# Altium schematic sheet extBoard_sheet5_connectors.SchDoc: EXT BOARD - Connectors
size A4; Revision: 0.1.0; SheetNumber: 5; SheetTotal: 5; Author: NALO; DrawnBy: NALO; DocumentSize: A4; PCAName: EXT BOARD; ProjectName: Bachelor's Thesis
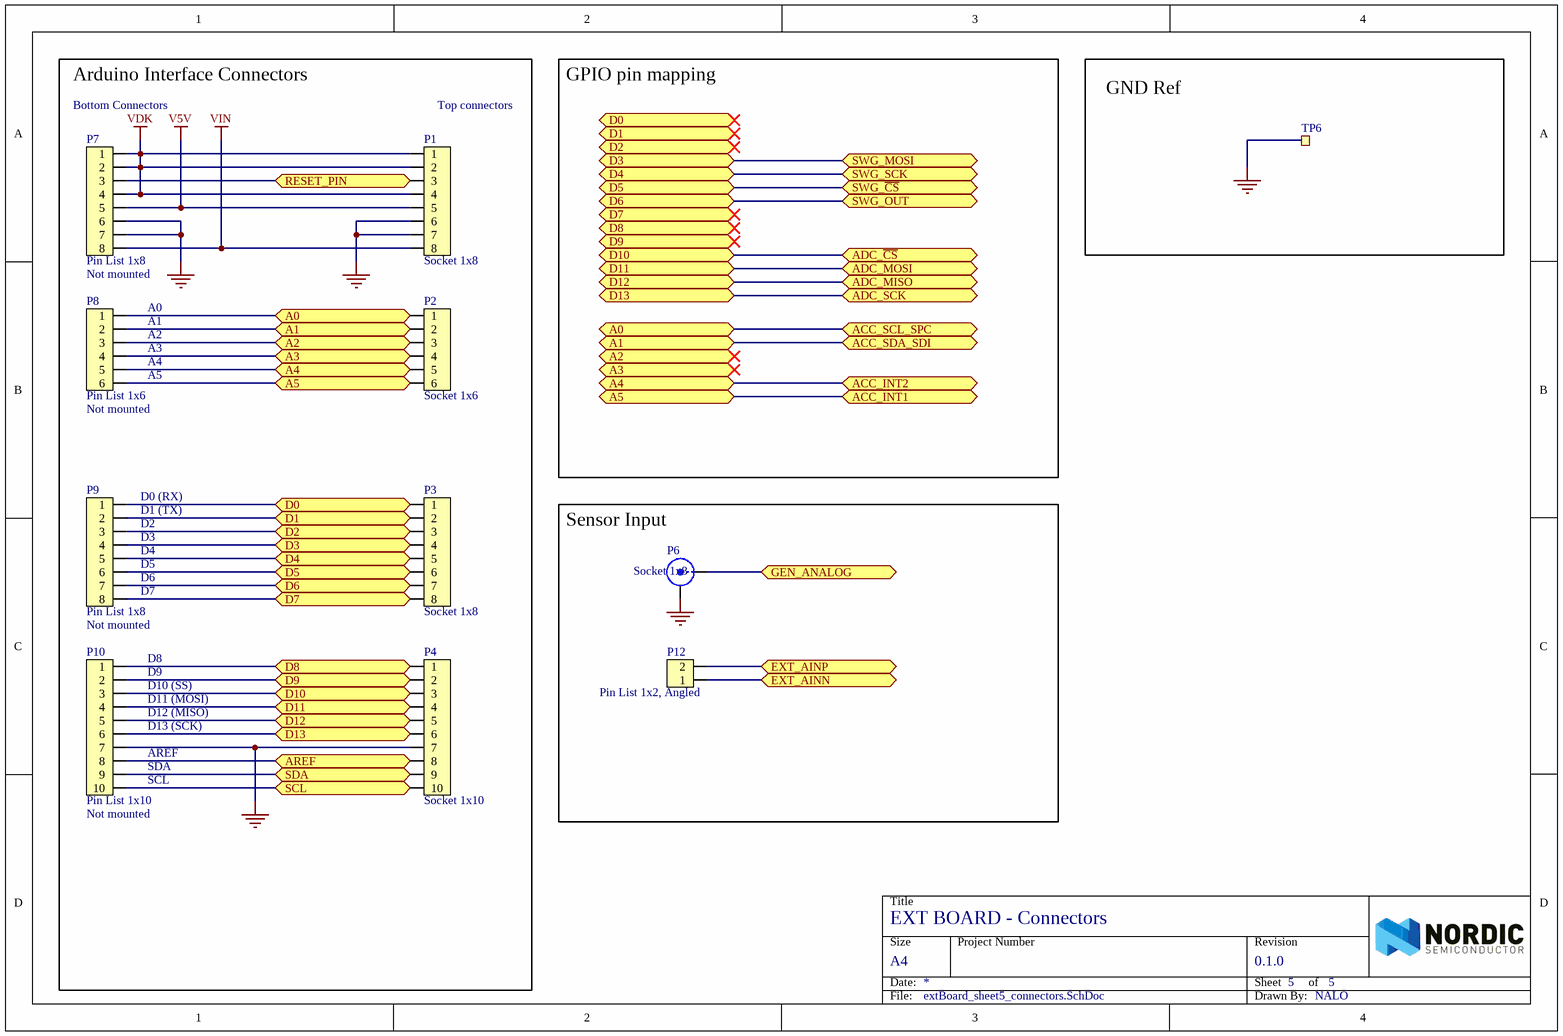
[diagram p0: extBoard_sheet5_connectors.SchDoc]

## Parts
P1  Socket 1x8  [SOCKET_1x8_SMD]
P2  Socket 1x6  [SOCKET_1x6_SMD]
P3  Socket 1x8  [SOCKET_1x8_SMD]
P4  Socket 1x10  [SOCKET_1x10_SMD]
P6  Socket 1x8  [BNC_RA CON]
P7  Pin List 1x8  Assembly: Not mounted  [LIST_1x8_SMD]
P8  Pin List 1x6  Assembly: Not mounted  [LIST_1x6_SMD]
P9  Pin List 1x8  Assembly: Not mounted  [LIST_1x8_SMD]
P10  Pin List 1x10  Assembly: Not mounted  [LIST_1x10_SMD]
P12  Pin List 1x2, Angled  [LIST_ANG_1x2-SMD-2.54MM]
TP6  TP  [TESTPAD-TH]  (value not drawn)  (no BOM)

## Blocks framed on the sheet
Arduino Interface Connectors: P1-P4 P7-P10
GND Ref: TP6
Sensor Input: P6 P12

## Ports
A0 (bidir), A1 (bidir), A2 (bidir), A3 (bidir), A4 (bidir), A5 (bidir), ACC_INT1 (bidir), ACC_INT2 (bidir), ACC_SCL_SPC (bidir), ACC_SDA_SDI (bidir), ADC_MISO (bidir), ADC_MOSI (bidir), ADC_SCK (bidir), ADC_~{CS} (bidir), AREF (bidir), D0 (bidir), D1 (bidir), D2 (bidir), D3 (bidir), D4 (bidir), D5 (bidir), D6 (bidir), D7 (bidir), D8 (bidir), D9 (bidir), D10 (bidir), D11 (bidir), D12 (bidir), D13 (bidir), EXT_AINN (bidir), EXT_AINP (bidir), GEN_ANALOG (bidir), RESET_PIN (bidir), SCL (bidir), SDA (bidir), SWG_MOSI (bidir), SWG_OUT (bidir), SWG_SCK (bidir), SWG_~{CS} (bidir)

## Nets
GND: P1.6 P1.7 P4.7 P6.2(Y) P7.6 P7.7 P10.7 TP6.1
V5V: P1.5 P7.5
VDK: P1.1 P1.2 P1.4 P7.1 P7.2 P7.4
VIN: P1.8 P7.8
A0: P2.1 P8.1 ; port A0, port ACC_SCL_SPC
A1: P2.2 P8.2 ; port A1, port ACC_SDA_SDI
A2: P2.3 P8.3 ; port A2
A3: P2.4 P8.4 ; port A3
A4: P2.5 P8.5 ; port A4, port ACC_INT2
A5: P2.6 P8.6 ; port A5, port ACC_INT1
ADC_~{CS}: P4.3 P10.3 ; port D10, port ADC_~{CS}
ADC_MISO: P4.5 P10.5 ; port D12, port ADC_MISO
ADC_MOSI: P4.4 P10.4 ; port D11, port ADC_MOSI
ADC_SCK: P4.6 P10.6 ; port D13, port ADC_SCK
AREF: P4.8 P10.8 ; port AREF
D0: P3.1 P9.1 ; port D0
D1: P3.2 P9.2 ; port D1
D2: P3.3 P9.3 ; port D2
D3: P3.4 P9.4 ; port D3, port SWG_MOSI
D4: P3.5 P9.5 ; port D4, port SWG_SCK
D5: P3.6 P9.6 ; port D5, port SWG_~{CS}
D6: P3.7 P9.7 ; port D6, port SWG_OUT
D7: P3.8 P9.8 ; port D7
D8: P4.1 P10.1 ; port D8
D9: P4.2 P10.2 ; port D9
EXT_AINN: P12.1 ; port EXT_AINN
EXT_AINP: P12.2 ; port EXT_AINP
GEN_ANALOG: P6.1(X) ; port GEN_ANALOG
RESET_PIN: P1.3 P7.3 ; port RESET_PIN
SCL: P4.10 P10.10 ; port SCL
SDA: P4.9 P10.9 ; port SDA

## Notes on the sheet
- (near P7) Bottom Connectors
- (near P1) Top connectors
- GPIO pin mapping
- (near P8) A0
- (near P8) A1
- (near P8) A2
- (near P8) A3
- (near P8) A4
- (near P8) A5
- (near P9) D0 (RX)
- (near P9) D1 (TX)
- (near P9) D2
- (near P9) D3
- (near P9) D4
- (near P9) D5
- (near P9) D6
- (near P9) D7
- (near P10) D8
- (near P10) D9
- (near P10) D10 (SS)
- (near P10) D11 (MOSI)
- (near P10) D12 (MISO)
- (near P10) AREF
- (near P10) D13 (SCK)
- (near P10) SDA
- (near P10) SCL
- Title
- Size
- Date:
- Project Number
- Sheet         of
- Revision
- File:
- Drawn By:

## Library data of the parts
P1 P3 = Socket 1x8 SMD: Socket 1x8, 2.54mm (100mil), SMD; Manufacturer: W-CON; Manufacturer Part Number: 2171-108MS0CUNR1; 2nd source part number: SSM-108-F-SV-P-TR; Artikkelnr Noca: 55030002; Artikkelnr Simpro: N.A.; Part Number: Socket 1x8 SMD; Datasheet: *; Footprint Doc: SOCKET_1x8_SMD; LatestRevisionDate: 2016-01-22; Pin Count: 8; Publisher: Nordic Semiconductor; Published: 2016-01-22; Value: Socket 1x8; Note: *; Supplier: Cabcon; Supplier part number: 2171-108MS0CUNR1; 2nd source Supplier: Samtec
P2 = Socket 1x6 SMD: Socket 1x6, 2.54mm (100mil), SMD; Manufacturer: W-CON; Manufacturer Part Number: 2171-106MS0CUNR1; 2nd source part number: SSM-106-F-SV-P-TR; Artikkelnr Noca: 55030001; Artikkelnr Simpro: N.A.; Part Number: Socket 1x6 SMD; Datasheet: *; Footprint Doc: SOCKET_1x6_SMD; LatestRevisionDate: 2016-01-22; Pin Count: 6; Publisher: Nordic Semiconductor; Published: 2016-01-22; Value: Socket 1x6; Note: *; Supplier: Cabcon; Supplier part number: 2171-106MS0CUNR1; 2nd source Supplier: Samtec
P4 = Socket 1x10 SMD: Socket 1x10, 2.54mm (100mil), SMD; Manufacturer: W-CON; Manufacturer Part Number: 2171-110MS0CUNR1; 2nd source part number: SSM-110-F-SV-P-TR; Artikkelnr Noca: 55030004; Artikkelnr Simpro: N.A.; Part Number: Socket 1x10 SMD; Datasheet: *; Footprint Doc: SOCKET_1x10_SMD; LatestRevisionDate: 2016-01-22; Pin Count: 10; Publisher: Nordic Semiconductor; Published: 2016-01-22; Value: Socket 1x10; Note: *; Supplier: Cabcon; Supplier part number: 2171-110MS0CUNR1; 2nd source Supplier: Samtec
P6 = BNC: BNC Elbow Connector; LatestRevisionDate: 17-Jul-2002; LatestRevisionNote: Re-released for DXP Platform.; Publisher: Altium Limited
P7 P9 = Pin List 1x8 SMD: Pin List 1x8, 2.54mm (100mil), SMD; Manufacturer: W-CON; Manufacturer Part Number: 1125-1108S0M116R2; 2nd source part number: TSM-108-01-L-SV-P-TR; Artikkelnr Noca: 55010006; Artikkelnr Simpro: N.A.; Part Number: Pin List 1x8 SMD; Datasheet: \\hizz\pro\app9717\Datasheet\connectores\W-CON\1125-11XXXXMXXXXX.pdf; LatestRevisionDate: 2016-01-22; Publisher: Nordic Semiconductor; Published: 2016-01-22; Value: Pin List 1x8; Note: *; Supplier: Cabcon; Supplier part number: 1125-1108S0M116R2; 2nd source Supplier: Samtec; Pin Count: 8; Footprint Doc: LIST_1x8_SMD
P8 = Pin List 1x6 SMD: Pin List 1x6, 2.54mm (100mil), SMD; Manufacturer: W-CON; Manufacturer Part Number: 1125-1106S0M116R2; 2nd source part number: TSM-106-01-L-SV-P-TR; Artikkelnr Noca: 55010026; Artikkelnr Simpro: N.A.; Part Number: Pin List 1x6 SMD; Datasheet: \\hizz\pro\app9717\Datasheet\connectores\W-CON\1125-11XXXXMXXXXX.pdf; LatestRevisionDate: 2016-03-29; Pin Count: 6; Publisher: Nordic Semiconductor; Published: 2016-03-29; Value: Pin List 1x6; Note: *; Supplier: Cabcon; Supplier part number: 1125-1106S0M116R2; 2nd source Supplier: Samtec; Footprint Doc: LIST_1x6_SMD
P10 = Pin List 1x10 SMD: Pin List 1x10, 2.54mm (100mil), SMD; Manufacturer: W-CON; Manufacturer Part Number: 1125-1110S0M116R2; 2nd source part number: TSM-110-01-L-SV-P-TR; Artikkelnr Noca: 55010028; Artikkelnr Simpro: N.A.; Part Number: Pin List 1x10 SMD; Datasheet: \\hizz\pro\app9717\Datasheet\connectores\W-CON\1125-11XXXXMXXXXX.pdf; LatestRevisionDate: 2016-03-29; Publisher: Nordic Semiconductor; Published: 2016-03-29; Value: Pin List 1x10; Note: *; Supplier: Cabcon; Supplier part number: 1125-1110S0M116R2; 2nd source Supplier: Samtec; Pin Count: 10; Footprint Doc: LIST_1x10_SMD
P12 = Pin List Ang 1x2 SMD, 2.54mm: Pin List 1x2, 2.54mm (100mil), Right Angled, SMD; Manufacturer: W-CON; Manufacturer Part Number: 1125B-1102S0Z135R2; 2nd source part number: TSM-102-01-L-SH-A; Artikkelnr Noca: 55010023; Artikkelnr Simpro: N.A.; Part Number: Pin List Ang 1x2 SMD, 2.54mm; Datasheet: \\hizz\pro\app9717\Datasheet\connectores\W-CON\1125B-11XXXXZXXXXX.pdf; Footprint Doc: LIST_ANG_1x2-SMD-2.54MM; LatestRevisionDate: 2016-05-26; Pin Count: 2; Publisher: Nordic Semiconductor; Published: 2016-01-22; Value: Pin List 1x2, Angled; Note: *; Supplier: Cabcon; Supplier part number: 1125B-1102S0Z135R2; 2nd source Supplier: Samtec
TP6 = Testpoint TH: Testpoint, through hole; Artikkelnr Noca: N.A.; Part Number: Testpoint TH; Manufacturer: *; Manufacturer Part Number: *; Datasheet: *; Footprint Doc: TESTPAD-TH; LatestRevisionDate: 2009-12-12; Pin Count: 1; Publisher: Nordic Semiconductor; Published: 2009-12-12; Value: TP; Note: *; Supplier: *; Supplier part number: *; 2nd source Supplier: *; 2nd source part number: *; Artikkelnr Simpro: N.A.